# EAGLE design V3 (EAGLE 7.5.0)
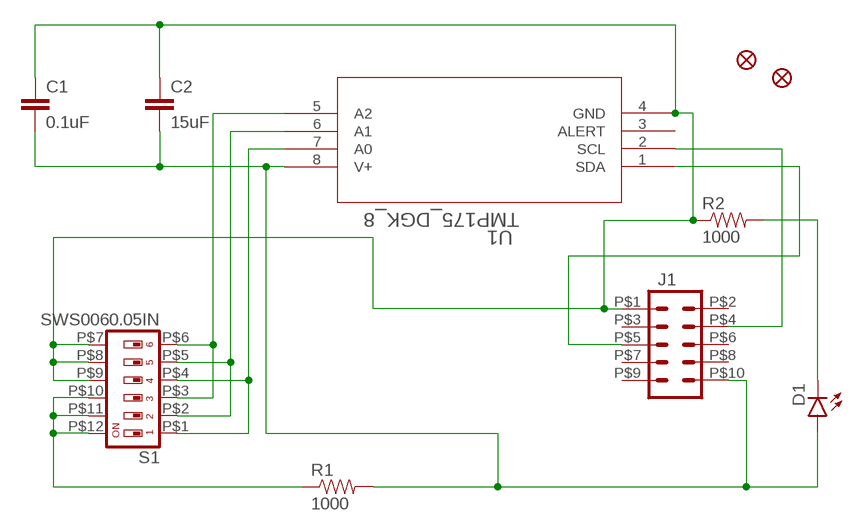
[diagram p0: schematic, sheet 1]

## Parts
C1  0.1uF  22UF-6.3V-20%(0805)  [0805]
C2  15uF  CAP0805  [0805]
D1  LED-BLUE1206  [LED-1206]
FID1  FIDUCIAL1X2  [FIDUCIAL-1X2]
FID3  FIDUCIAL1X2  [FIDUCIAL-1X2]
J1  M05X22X5-UNSHROUDED_SMD  [2X5-UNSHROUDED_SMD]
R1  1000  RESISTOR0805-RES  [0805]
R2  1000  RESISTOR0805-RES  [0805]
S1  SWS0060.05IN  [SMS-006]
U1  TMP175_DGK_8  [DGK8]

## Nets
A1: S1.P$2 S1.P$5 U1.6(A1)
A2: S1.P$3 S1.P$6 U1.5(A2)
GND: C1.1 C2.1 J1.P$1 R2.1 S1.P$7 S1.P$8 S1.P$9 U1.4(GND)
N$2: R1.1 S1.P$10 S1.P$11 S1.P$12
N$6: S1.P$1 S1.P$4 U1.7(A0)
N$9: D1.C R2.2
POWER: C1.2 C2.2 D1.A J1.P$10 R1.2 U1.8(V+)
SCL: J1.P$4 U1.2(SCL)
SDA: J1.P$5 U1.1(SDA)
Unconnected: J1.P$2 J1.P$3 J1.P$6 J1.P$7 J1.P$8 J1.P$9 U1.3(ALERT)

## Library data of the parts
C1 = SparkFun-Capacitors:22UF-6.3V-20%(0805): CAP-08402 Ceramic; PROD_ID: CAP-08402; VALUE: 22uF
C2 = SparkFun-Capacitors:CAP: Capacitor Standard 0603 ceramic capacitor, and 0.1" leaded capacitor.
D1 = SparkFun-LED:LED-BLUE: Blue LEDs for production use Various blue LEDs stocked by SparkFun production 0603 - DIO-08575 Rebel - DIO-09553 1206 - DIO-09911; PROD_ID: DIO-09911; VALUE: BLUE
FID1 FID3 = SparkFun-Aesthetics:FIDUCIAL: Fiducial Alignment Points Various fiducial points for machine vision alignment.
J1 = SparkFun-Connectors:M05X2: Header 5x2 Standard 10-pin dual row 0.1" header. Commonly used with AVR-ISP. Use with Spark Fun Electronics SKU: PRT-00778
R1 R2 = SparkFun-Resistors:RESISTOR: Resistor Basic schematic elements and footprints for 0603, 1206, and PTH resistors.
S1 = roshea:SWS006: SMD Dip Switch 6 pol.
U1 = EagleNew:TMP175_DGK_8; DATASHEETURL: http://www.ti.com/lit/gpn/TMP175; DESCRIPTION: Digital Temperature Sensor with 2-Wire Interface; FAMILY_NAME: TEMPERATURE SENSOR; GENERIC_PART_NUMBER: TMP175; INDUSTRY_STD_PKG_TYPE: MSOP; MANUFACTURER: Texas Instruments; MANUFACTURER_PART_NUMBER: tmp175_dgk_8; PACKAGE_DESIGNATOR: DGK; PIN_COUNT: 8; VENDOR: Texas Instruments

## Net classes
0 default: width 0.152 mm, drill 0.254 mm, clearance 0.152 mm

## Board
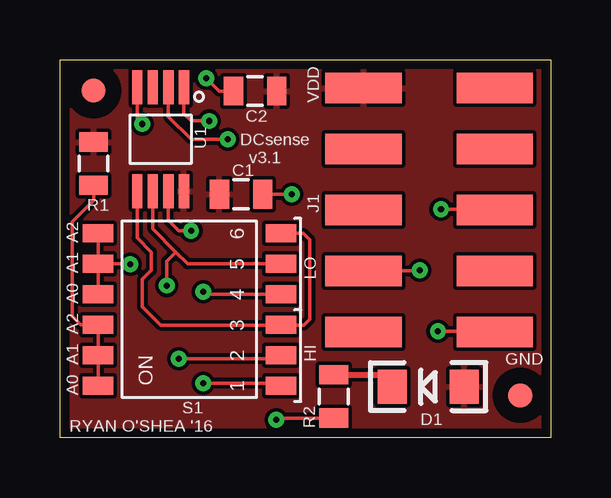
[diagram p1: board, top side]
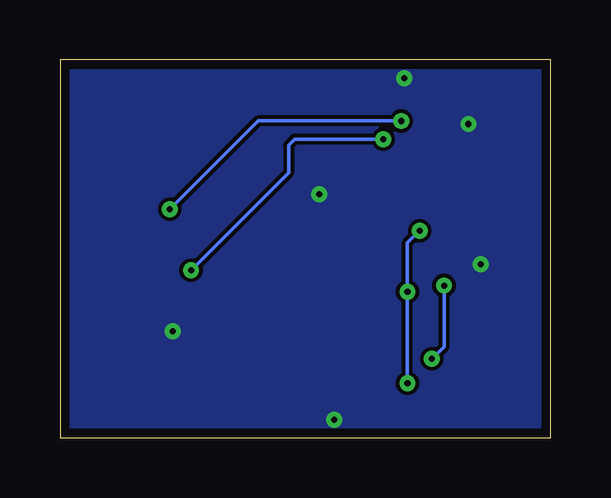
[diagram p2: board, bottom side, seen from below]

Size 20.45 x 15.75 mm. Coordinates in mm from the lower left corner, seen from the top.
Outline: 0,0 0,15.75 20.45,15.75 20.45,0 0,0
Copper layers (1*16): Top 0.035mm / dielectric 1.5mm / Bottom 0.035mm
Design rules "advanced_circuits": minimum track width 6mil, minimum drill 10mil, track to track 6mil, track to pad 6mil, pad to pad 6mil, via to via 6mil, smd to smd 6mil, copper to edge 15mil, drill to drill 8mil, minimum pad ring 10mil, minimum via ring 8mil, stop-mask expansion 2.5mil, vias tented up to drill 20mil, thermal gap 6mil

### Footprints (pad centres in the part's own frame; a part is rotated, then mirrored left to right if it is on the bottom)
0805 = smd 0.8 x 1.2: 1 -0.9,0; 2 0.9,0
LED-1206 = smd 1.2 x 1.4: A -1.5,0; C 1.5,0
FIDUCIAL-1X2 = smd 1 x 1: 1 0,0
2X5-UNSHROUDED_SMD = smd 1.27 x 3.175: P$1 1.27,2.54; P$2 1.27,8.001; P$3 3.81,2.54; P$4 3.81,8.001; P$5 6.35,2.54; P$6 6.35,8.001; P$7 8.89,2.54; P$8 8.89,8.001; P$9 11.43,2.54; P$10 11.43,8.001
SMS-006 = smd 0.76 x 1.27: P$1 0.5,1; P$2 1.77,1; P$3 3.04,1; P$4 4.31,1; P$5 5.58,1; P$6 6.85,1; P$7 6.85,8.62; P$8 5.58,8.62; P$9 4.31,8.62; P$10 3.04,8.62; P$11 1.77,8.62; P$12 0.5,8.62
DGK8 = smd 1.422 x 0.432: 1 -2.172,0.975; 2 -2.172,0.325; 3 -2.172,-0.325; 4 -2.172,-0.975; 5 2.172,-0.975; 6 2.172,-0.325; 7 2.172,0.325; 8 2.172,0.975

### Placement (x,y rotation side)
C1  7.54,10.16 180 top
C2  8.13,14.45 0 top
D1  15.34,2.13 180 top
FID1  1.4,14.48 0 top
FID3  19.18,1.78 0 top
J1  20.65,3.15 90 top
R1  1.4,11.43 90 top
R2  11.4,1.73 90 top
S1  10.21,1.68 90 top
U1  4.19,12.45 270 top

### Tracks (layer width: path | path; a pad name or v marks a point on that pad's centre or on a via)
A1  (via drill 0.25)
  Top 0.152: S1.P$5 5.32,7.26 4.83,7.75 | 4.83,7.75 3.87,8.71 U1.6 | S1.P$2 9.07,3.3 v4.95,3.3 | v4.45,6.35 4.45,7.37 4.83,7.75
  Bottom 0.152: v4.95,3.3 4.45,3.81 v4.45,6.35
A2
  Top 0.152: S1.P$6 10.14,8.53 10.41,8.26 10.41,4.95 10.16,4.7 9.23,4.7 S1.P$3 9.19,4.7 4.19,4.7 3.43,5.46 3.43,6.6 3.81,6.99 3.81,7.75 3.22,8.34 U1.5
GND  (via drill 0.25, 0.25 pad 0.25)
  Top 0.152: C2.1 6.63,14.45 v6.1,14.99 | U1.4 3.22,13.29 v3.43,13.08 | S1.P$8 S1.P$7 | S1.P$8 S1.P$9 | R2.1 9.08,0.83 v9.02,0.76 | v15.75,4.45 18.09,4.45 J1.P$1 | C1.1 v9.65,10.16 | S1.P$8 2.9,7.26 v2.92,7.24
  pour Bottom: 0,15.75 20.45,15.75 20.45,0 0,0
N$2
  Top 0.152: S1.P$12 S1.P$11 S1.P$10 0.87,4.72 0.51,5.08 0.51,9.02 1.4,9.91 R1.1
N$6  (via drill 0.25)
  Top 0.152: S1.P$4 6.08,5.99 v5.97,6.1 | v5.46,8.64 4.95,8.64 4.52,9.07 U1.7 | S1.P$1 9.1,2.29 v5.97,2.29
  Bottom 0.152: v5.46,8.64 5.97,8.13 v5.97,6.1 v5.97,2.29
N$9
  Top 0.254: R2.2 13.35,2.63 D1.C
POWER
  pour Top (isolate 0.152): 0,15.75 20.45,15.75 20.45,0 0,0
SCL  (via drill 0.25)
  Top 0.152: U1.2 4.52,13.39 5.46,12.45 v6.99,12.45 | J1.P$4 14.96,6.96 v14.99,6.99
  Bottom 0.152: v6.99,12.45 10.67,12.45 10.92,12.19 10.92,11.05 v14.99,6.99
SDA  (via drill 0.25)
  Top 0.152: U1.1 5.17,13.5 5.46,13.21 v6.22,13.21 | v15.88,9.53 18.09,9.53 J1.P$5
  Bottom 0.152: v6.22,13.21 12.19,13.21 v15.88,9.53

### Text on the board
tNames: VDD | DCsense / v3.1 | J1 | A2 | A1 | LO | A0 | A2 | A1 | HI | GND | A0 | S1 | RYAN O'SHEA '16